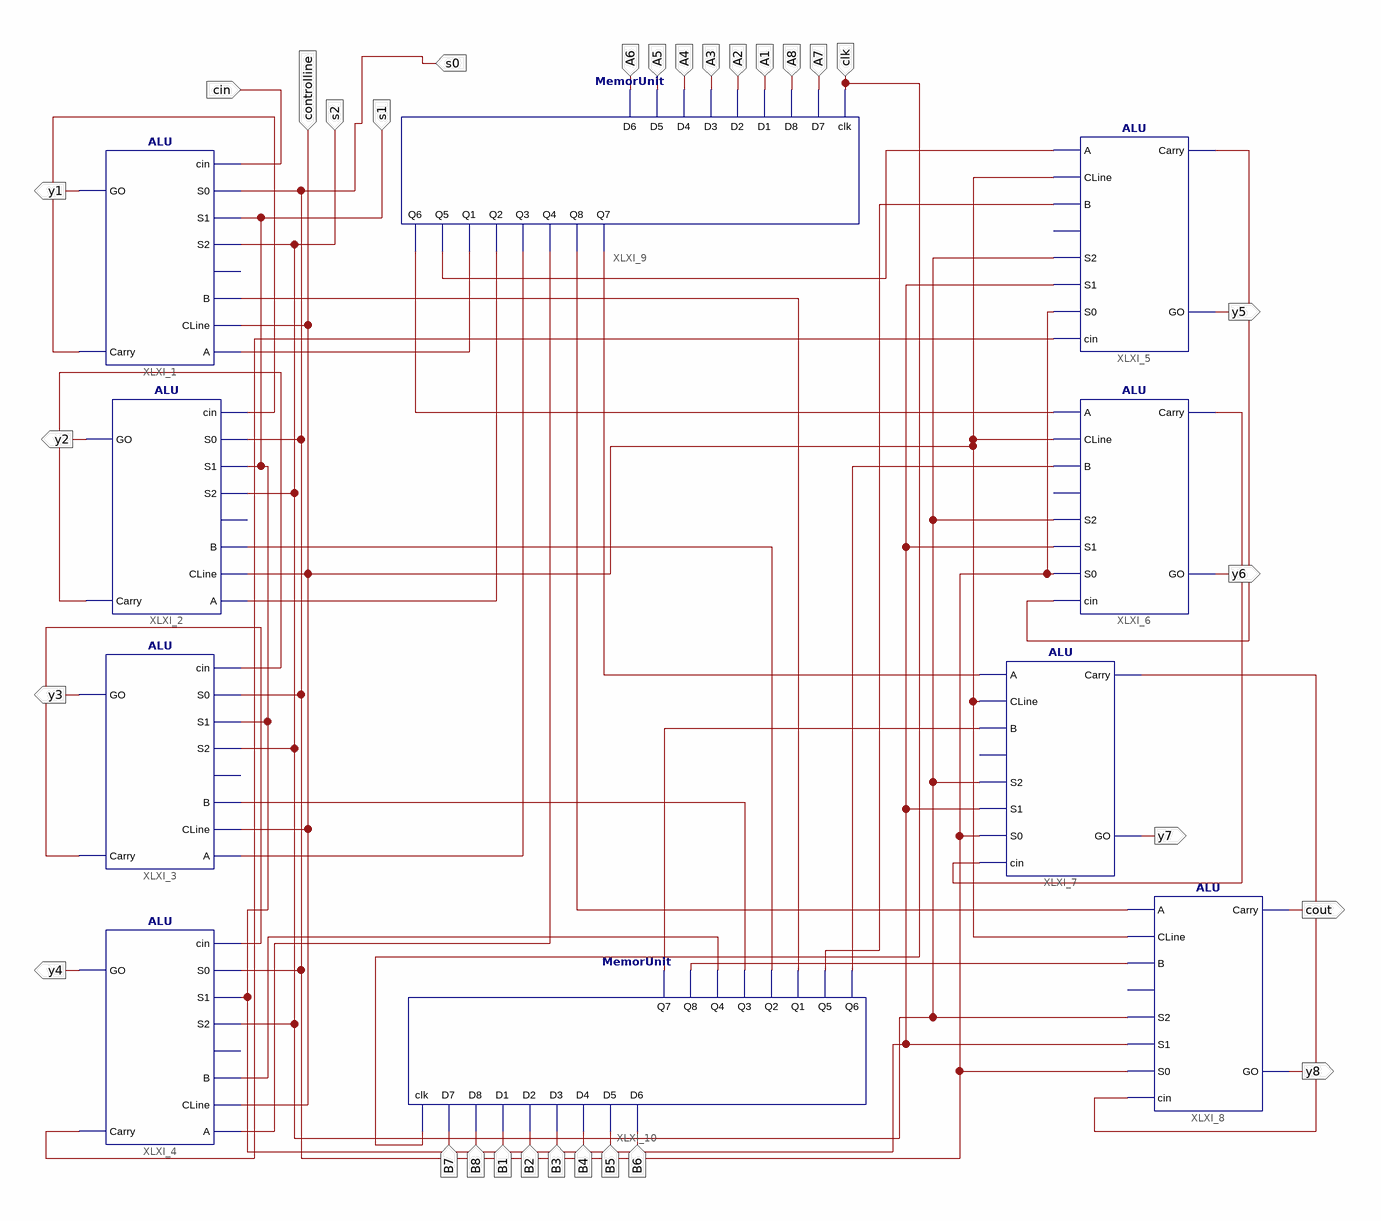
[diagram p0: schematic sheet 1]
// Xilinx ISE schematic ALUEightBit.sch (spartan3a) as structural Verilog: 10 symbols, 31 ports
module ALUEightBit (
  input  controlline,
  input  cin,
  input  s1,
  input  s2,
  input  A6,
  input  A5,
  input  A4,
  input  A3,
  input  A2,
  input  A1,
  input  A8,
  input  A7,
  input  clk,
  input  B7,
  input  B8,
  input  B1,
  input  B2,
  input  B3,
  input  B4,
  input  B5,
  input  B6,
  input  s0,
  output y1,
  output y2,
  output y3,
  output y4,
  output y8,
  output cout,
  output y7,
  output y6,
  output y5
);

  wire XLXN_1, XLXN_2, XLXN_3, XLXN_4, XLXN_5, XLXN_6, XLXN_7, XLXN_8, XLXN_9, XLXN_10, XLXN_11, XLXN_12,
       XLXN_13, XLXN_14, XLXN_15, XLXN_16, XLXN_17, XLXN_18, XLXN_19, XLXN_20, XLXN_21, XLXN_25, XLXN_26;

  ALU XLXI_1 (
    .A(XLXN_1), .CLine(controlline), .B(XLXN_13), .S2(s2), .S1(s1), .S0(s0), .cin(cin), .Carry(XLXN_17),
    .GO(y1));  // open: Slt
  ALU XLXI_2 (
    .A(XLXN_2), .CLine(controlline), .B(XLXN_14), .S2(s2), .S1(s1), .S0(s0), .cin(XLXN_17), .Carry(XLXN_18),
    .GO(y2));  // open: Slt
  ALU XLXI_3 (
    .A(XLXN_3), .CLine(controlline), .B(XLXN_15), .S2(s2), .S1(s1), .S0(s0), .cin(XLXN_18), .Carry(XLXN_19),
    .GO(y3));  // open: Slt
  ALU XLXI_4 (
    .A(XLXN_4), .CLine(controlline), .B(XLXN_16), .S2(s2), .S1(s1), .S0(s0), .cin(XLXN_19), .Carry(XLXN_20),
    .GO(y4));  // open: Slt
  ALU XLXI_5 (
    .A(XLXN_5), .CLine(controlline), .B(XLXN_12), .S2(s2), .S1(s1), .S0(s0), .cin(XLXN_20), .Carry(XLXN_21),
    .GO(y5));  // open: Slt
  ALU XLXI_6 (
    .A(XLXN_6), .CLine(controlline), .B(XLXN_11), .S2(s2), .S1(s1), .S0(s0), .cin(XLXN_21), .Carry(XLXN_25),
    .GO(y6));  // open: Slt
  ALU XLXI_7 (
    .A(XLXN_7), .CLine(controlline), .B(XLXN_9), .S2(s2), .S1(s1), .S0(s0), .cin(XLXN_25), .Carry(XLXN_26),
    .GO(y7));  // open: Slt
  ALU XLXI_8 (
    .A(XLXN_8), .CLine(controlline), .B(XLXN_10), .S2(s2), .S1(s1), .S0(s0), .cin(XLXN_26), .Carry(cout),
    .GO(y8));  // open: Slt
  MemorUnit XLXI_9 (
    .clk(clk), .D7(A7), .D8(A8), .D1(A1), .D2(A2), .D3(A3), .D4(A4), .D5(A5), .D6(A6), .Q7(XLXN_7),
    .Q8(XLXN_8), .Q4(XLXN_4), .Q3(XLXN_3), .Q2(XLXN_2), .Q1(XLXN_1), .Q5(XLXN_5), .Q6(XLXN_6));
  MemorUnit XLXI_10 (
    .clk(clk), .D7(B7), .D8(B8), .D1(B1), .D2(B2), .D3(B3), .D4(B4), .D5(B5), .D6(B6), .Q7(XLXN_9),
    .Q8(XLXN_10), .Q4(XLXN_16), .Q3(XLXN_15), .Q2(XLXN_14), .Q1(XLXN_13), .Q5(XLXN_12), .Q6(XLXN_11));
endmodule
